# Altium schematic sheet DSO_Power.SchDoc: Schematic_Name
size A4; CompanyName: University of Melbourne; Engineer: Your Name Here; DocumentNumber: 1; Revision: 0.1; SheetNumber: 1; SheetTotal: 1; Title_Project: Project_Title; StudentNo: Student No.
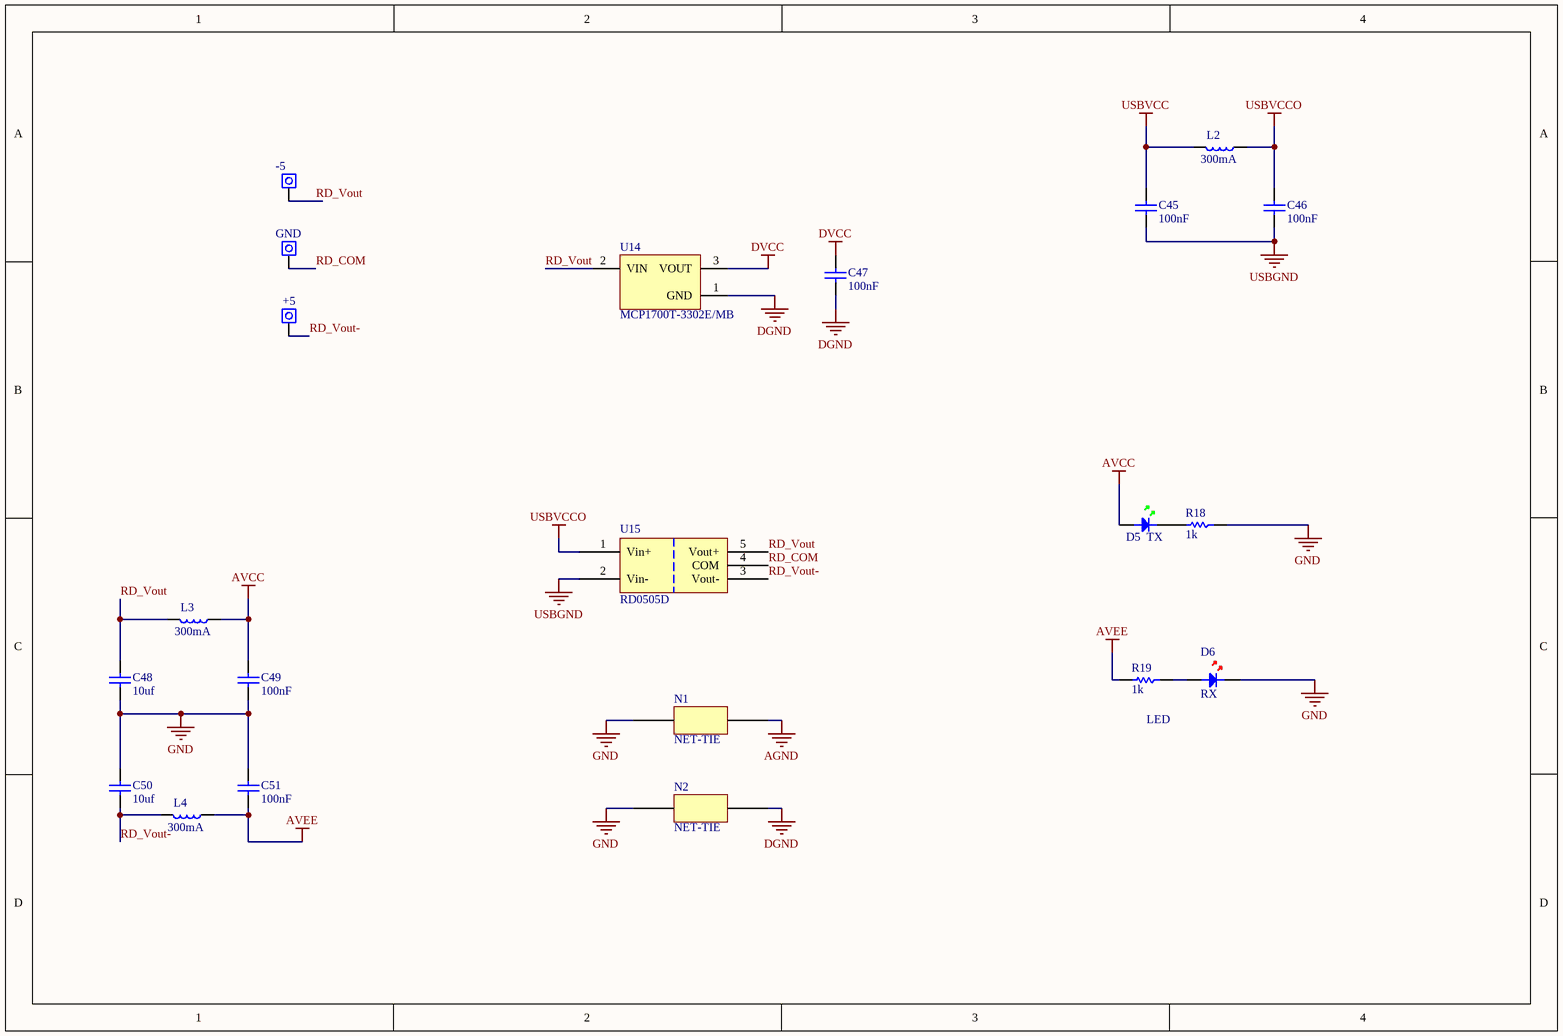
[diagram p0: DSO_Power.SchDoc]

## Parts
C45  100nF  [0805C]
C46  100nF  [0805C]
C47  100nF  [0805C]
C48  10uf  [0805C]
C49  100nF  [0805C]
C50  10uf  [0805C]
C51  100nF  [0805C]
D5  TX  [0805D-GREEN]
D6  RX  [0805D-RED]
L2  300mA  [0805]
L3  300mA  [0805]
L4  300mA  [0805]
N1  NET-TIE  [NET-TIE]  (net tie, no BOM)
N2  NET-TIE  [NET-TIE]  (net tie, no BOM)
R18  1k  [0805]
R19  1k  [0805]
TP4  -5  [PIN 1.8mm]
TP5  GND  [PIN 1.8mm]
TP6  +5  [PIN 1.8mm]
U14  MCP1700T-3302E/MB  [SOT89]
U15  RD0505D  [SIP_NMG]

## Nets
AGND: N1.1
AVCC: C49.1 D5.A L3.1
AVEE: C51.2 L4.1 R19.2
DGND: C47.2 N2.1 U14.1(GND)
DVCC: C47.1 U14.3(VOUT)
GND: C48.2 C49.2 C50.1 C51.1 D6.A N1.0 N2.0 R18.1
USBGND: C45.2 C46.2 U15.2(Vin-)
USBVCC: C45.1 L2.2
USBVCCO: C46.1 L2.1 U15.1(Vin+)
RD_COM: TP5.1 U15.4(COM)
RD_Vout: C48.1 L3.2 TP4.1 U14.2(VIN) U15.5(Vout+)
RD_Vout-: C50.2 L4.2 TP6.1 U15.3(Vout-)
NetD5_K: D5.K R18.2
NetD6_K: D6.K R19.1

## Notes on the sheet
- LED

## Library data of the parts
C45-C51 = C: Capacitor; Reviewed by: RM - 2018/08/05; Revision: July-2002: Re-released for DXP Platform.; Supplier 1: *; Supplier Part Number 1: *
  C45-C47 C49 C51: Value: 100nF
  C48 C50: Value: 10uf
D5 = LED GREEN: Light Emitting Diode; Reviewed by: RM - 2018/08/05; Revision: July-2002: Re-released for DXP Platform.; Supplier 1: Digi-Key; Supplier Part Number 1: 160-1423-1-ND
D6 = LED RED: Light Emitting Diode; Reviewed by: RM - 2018/08/05; Revision: July-2002: Re-released for DXP Platform.; Supplier 1: Digi-Key; Supplier Part Number 1: 475-1415-1-ND
L2-L4 = I: Inductor; Reviewed by: RM - 2018/08/05; Supplier 1: *; Supplier Part Number 1: *; Value: 300mA
R18 R19 = R: Resistor; Reviewed by: RM - 2018/08/05; Value: 1k; Supplier 1: *; Suppler Part Number 1: *
TP4-TP6 = WIRE: Pad
U14 = MCP1700T: Low Quiescent Current LDO, 3-Pin SOT-89, Extended Temperature, Tape and Reel; Reviewed by: RM - 2018/08/05; Supplier 1: Digi-Key; Supplier Part Number 1: MCP1700T3302EMBCT-ND
U15 = RD0505D: (ADV) DC to DC converter 5V in +-5V out; Reviewed by: RM - 2018/08/05; Supplier Part Number 1: 945-1136-ND; Supplier 1: Digi-Key